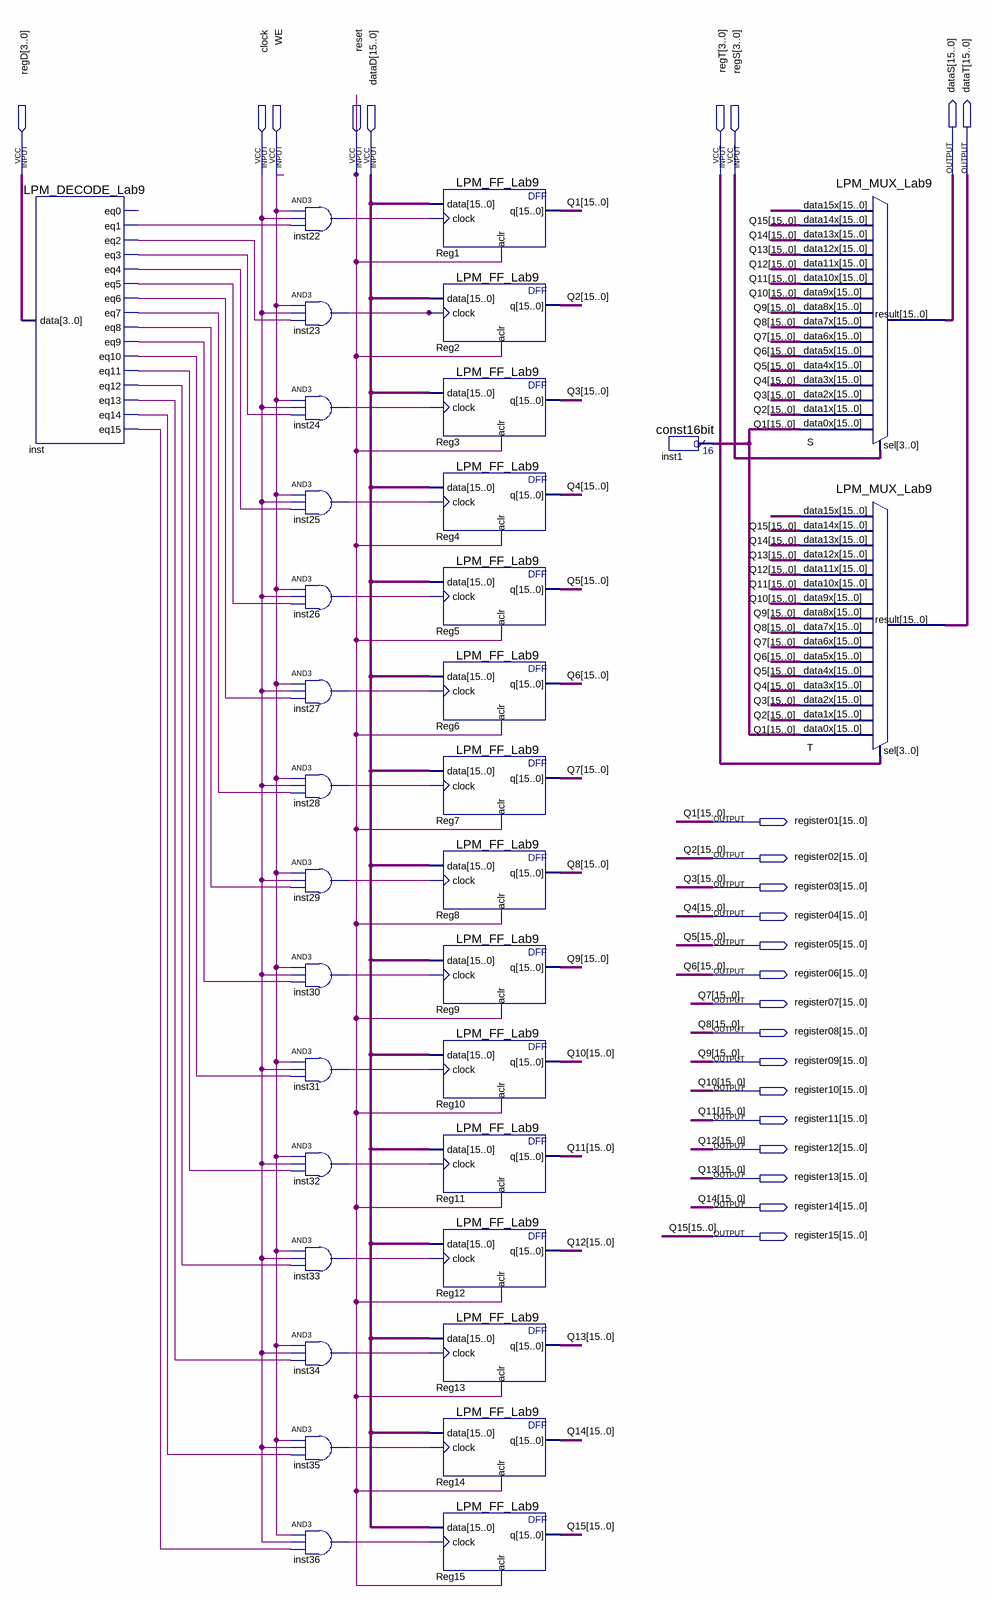
[diagram p0: schematic sheet]
// Quartus schematic 230_Lab9.bdf as structural Verilog: 34 symbols, 24 pins
module \230_Lab9  (
  input  [3:0] regD,
  input  clock,
  input  WE,
  input  reset,
  input  [15:0] dataD,
  input  [3:0] regT,
  input  [3:0] regS,
  output [15:0] dataS,
  output [15:0] dataT,
  output [15:0] register01,
  output [15:0] register02,
  output [15:0] register03,
  output [15:0] register04,
  output [15:0] register05,
  output [15:0] register06,
  output [15:0] register07,
  output [15:0] register08,
  output [15:0] register09,
  output [15:0] register10,
  output [15:0] register11,
  output [15:0] register12,
  output [15:0] register13,
  output [15:0] register14,
  output [15:0] register15
);

  wire inst22_out, inst23_out, inst24_out, inst25_out, inst26_out, inst27_out, inst28_out, inst29_out,
       inst30_out, inst31_out, inst32_out, inst33_out, inst34_out, inst35_out, inst36_out, inst_eq1,
       inst_eq2, inst_eq3, inst_eq4, inst_eq5, inst_eq6, inst_eq7, inst_eq8, inst_eq9, inst_eq10, inst_eq11,
       inst_eq12, inst_eq13, inst_eq14, inst_eq15;
  wire [15:0] inst1_result;

  LPM_DECODE_Lab9 inst (
    .data(regD), .eq1(inst_eq1), .eq2(inst_eq2), .eq3(inst_eq3), .eq4(inst_eq4), .eq5(inst_eq5),
    .eq6(inst_eq6), .eq7(inst_eq7), .eq8(inst_eq8), .eq9(inst_eq9), .eq10(inst_eq10), .eq11(inst_eq11),
    .eq12(inst_eq12), .eq13(inst_eq13), .eq14(inst_eq14), .eq15(inst_eq15));  // open: eq0
  and inst22 (inst22_out, WE, clock, inst_eq1);
  and inst23 (inst23_out, WE, clock, inst_eq2);
  and inst24 (inst24_out, WE, clock, inst_eq3);
  and inst25 (inst25_out, WE, clock, inst_eq4);
  and inst26 (inst26_out, WE, clock, inst_eq5);
  and inst27 (inst27_out, WE, clock, inst_eq6);
  and inst28 (inst28_out, WE, clock, inst_eq7);
  and inst29 (inst29_out, WE, clock, inst_eq8);
  and inst30 (inst30_out, WE, clock, inst_eq9);
  and inst31 (inst31_out, WE, clock, inst_eq10);
  and inst32 (inst32_out, WE, clock, inst_eq11);
  and inst33 (inst33_out, WE, clock, inst_eq12);
  and inst34 (inst34_out, WE, clock, inst_eq13);
  and inst35 (inst35_out, WE, clock, inst_eq14);
  and inst36 (inst36_out, WE, clock, inst_eq15);
  LPM_FF_Lab9 Reg1 (.data(dataD), .clock(inst22_out), .aclr(reset), .q(register01));
  LPM_FF_Lab9 Reg2 (.data(dataD), .clock(inst23_out), .aclr(reset), .q(register02));
  LPM_FF_Lab9 Reg3 (.data(dataD), .clock(inst24_out), .aclr(reset), .q(register03));
  LPM_FF_Lab9 Reg4 (.data(dataD), .clock(inst25_out), .aclr(reset), .q(register04));
  LPM_FF_Lab9 Reg5 (.data(dataD), .clock(inst26_out), .aclr(reset), .q(register05));
  LPM_FF_Lab9 Reg6 (.data(dataD), .clock(inst27_out), .aclr(reset), .q(register06));
  LPM_FF_Lab9 Reg7 (.data(dataD), .clock(inst28_out), .aclr(reset), .q(register07));
  LPM_FF_Lab9 Reg8 (.data(dataD), .clock(inst29_out), .aclr(reset), .q(register08));
  LPM_FF_Lab9 Reg9 (.data(dataD), .clock(inst30_out), .aclr(reset), .q(register09));
  LPM_FF_Lab9 Reg10 (.data(dataD), .clock(inst31_out), .aclr(reset), .q(register10));
  LPM_FF_Lab9 Reg11 (.data(dataD), .clock(inst32_out), .aclr(reset), .q(register11));
  LPM_FF_Lab9 Reg12 (.data(dataD), .clock(inst33_out), .aclr(reset), .q(register12));
  LPM_FF_Lab9 Reg13 (.data(dataD), .clock(inst34_out), .aclr(reset), .q(register13));
  LPM_FF_Lab9 Reg14 (.data(dataD), .clock(inst35_out), .aclr(reset), .q(register14));
  LPM_FF_Lab9 Reg15 (.data(dataD), .clock(inst36_out), .aclr(reset), .q(register15));
  const16bit inst1 (.result(inst1_result));
  LPM_MUX_Lab9 S (
    .data15x(register15), .data14x(register14), .data13x(register13), .data12x(register12),
    .data11x(register11), .data10x(register10), .data9x(register09), .data8x(register08),
    .data7x(register07), .data6x(register06), .data5x(register05), .data4x(register04), .data3x(register03),
    .data2x(register02), .data1x(register01), .data0x(inst1_result), .sel(regS), .result(dataS));
  LPM_MUX_Lab9 T (
    .data15x(register15), .data14x(register14), .data13x(register13), .data12x(register12),
    .data11x(register11), .data10x(register10), .data9x(register09), .data8x(register08),
    .data7x(register07), .data6x(register06), .data5x(register05), .data4x(register04), .data3x(register03),
    .data2x(register02), .data1x(register01), .data0x(inst1_result), .sel(regT), .result(dataT));

  // Other names for the same wires on the sheet: Q1[15:0] = register01; Q2[15:0] = register02; Q3[15:0] = register03;
  //   Q4[15:0] = register04; Q5[15:0] = register05; Q6[15:0] = register06; Q7[15:0] = register07;
  //   Q8[15:0] = register08; Q9[15:0] = register09; Q10[15:0] = register10; Q11[15:0] = register11;
  //   Q12[15:0] = register12; Q13[15:0] = register13; Q14[15:0] = register14; Q15[15:0] = register15
endmodule
